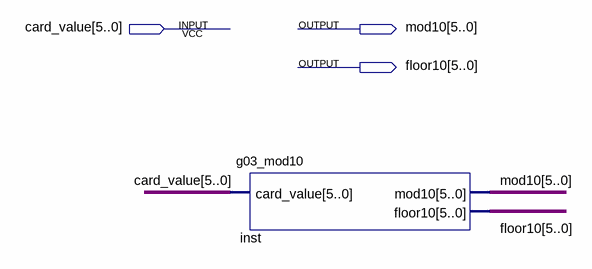
[diagram p0: schematic sheet]
// Quartus schematic g03_mod10_test.bdf as structural Verilog: 1 symbols, 3 pins
module g03_mod10_test (
  input  [5:0] card_value,
  output [5:0] mod10,
  output [5:0] floor10
);

  g03_mod10 inst (.card_value(card_value), .mod10(mod10), .floor10(floor10));
endmodule
